# Altium schematic sheet racer.SchDoc: Wacky Racers Racer
size A3; DrawnBy: Mark Arunchayanon, Abhi Chhabara, Luke Trenberth, Sasiru Goonatilake; Address1: ECE Department; Address2: University of Canterbury; Address3: Christchurch 8041; Address4: New Zealand; Revision: 1
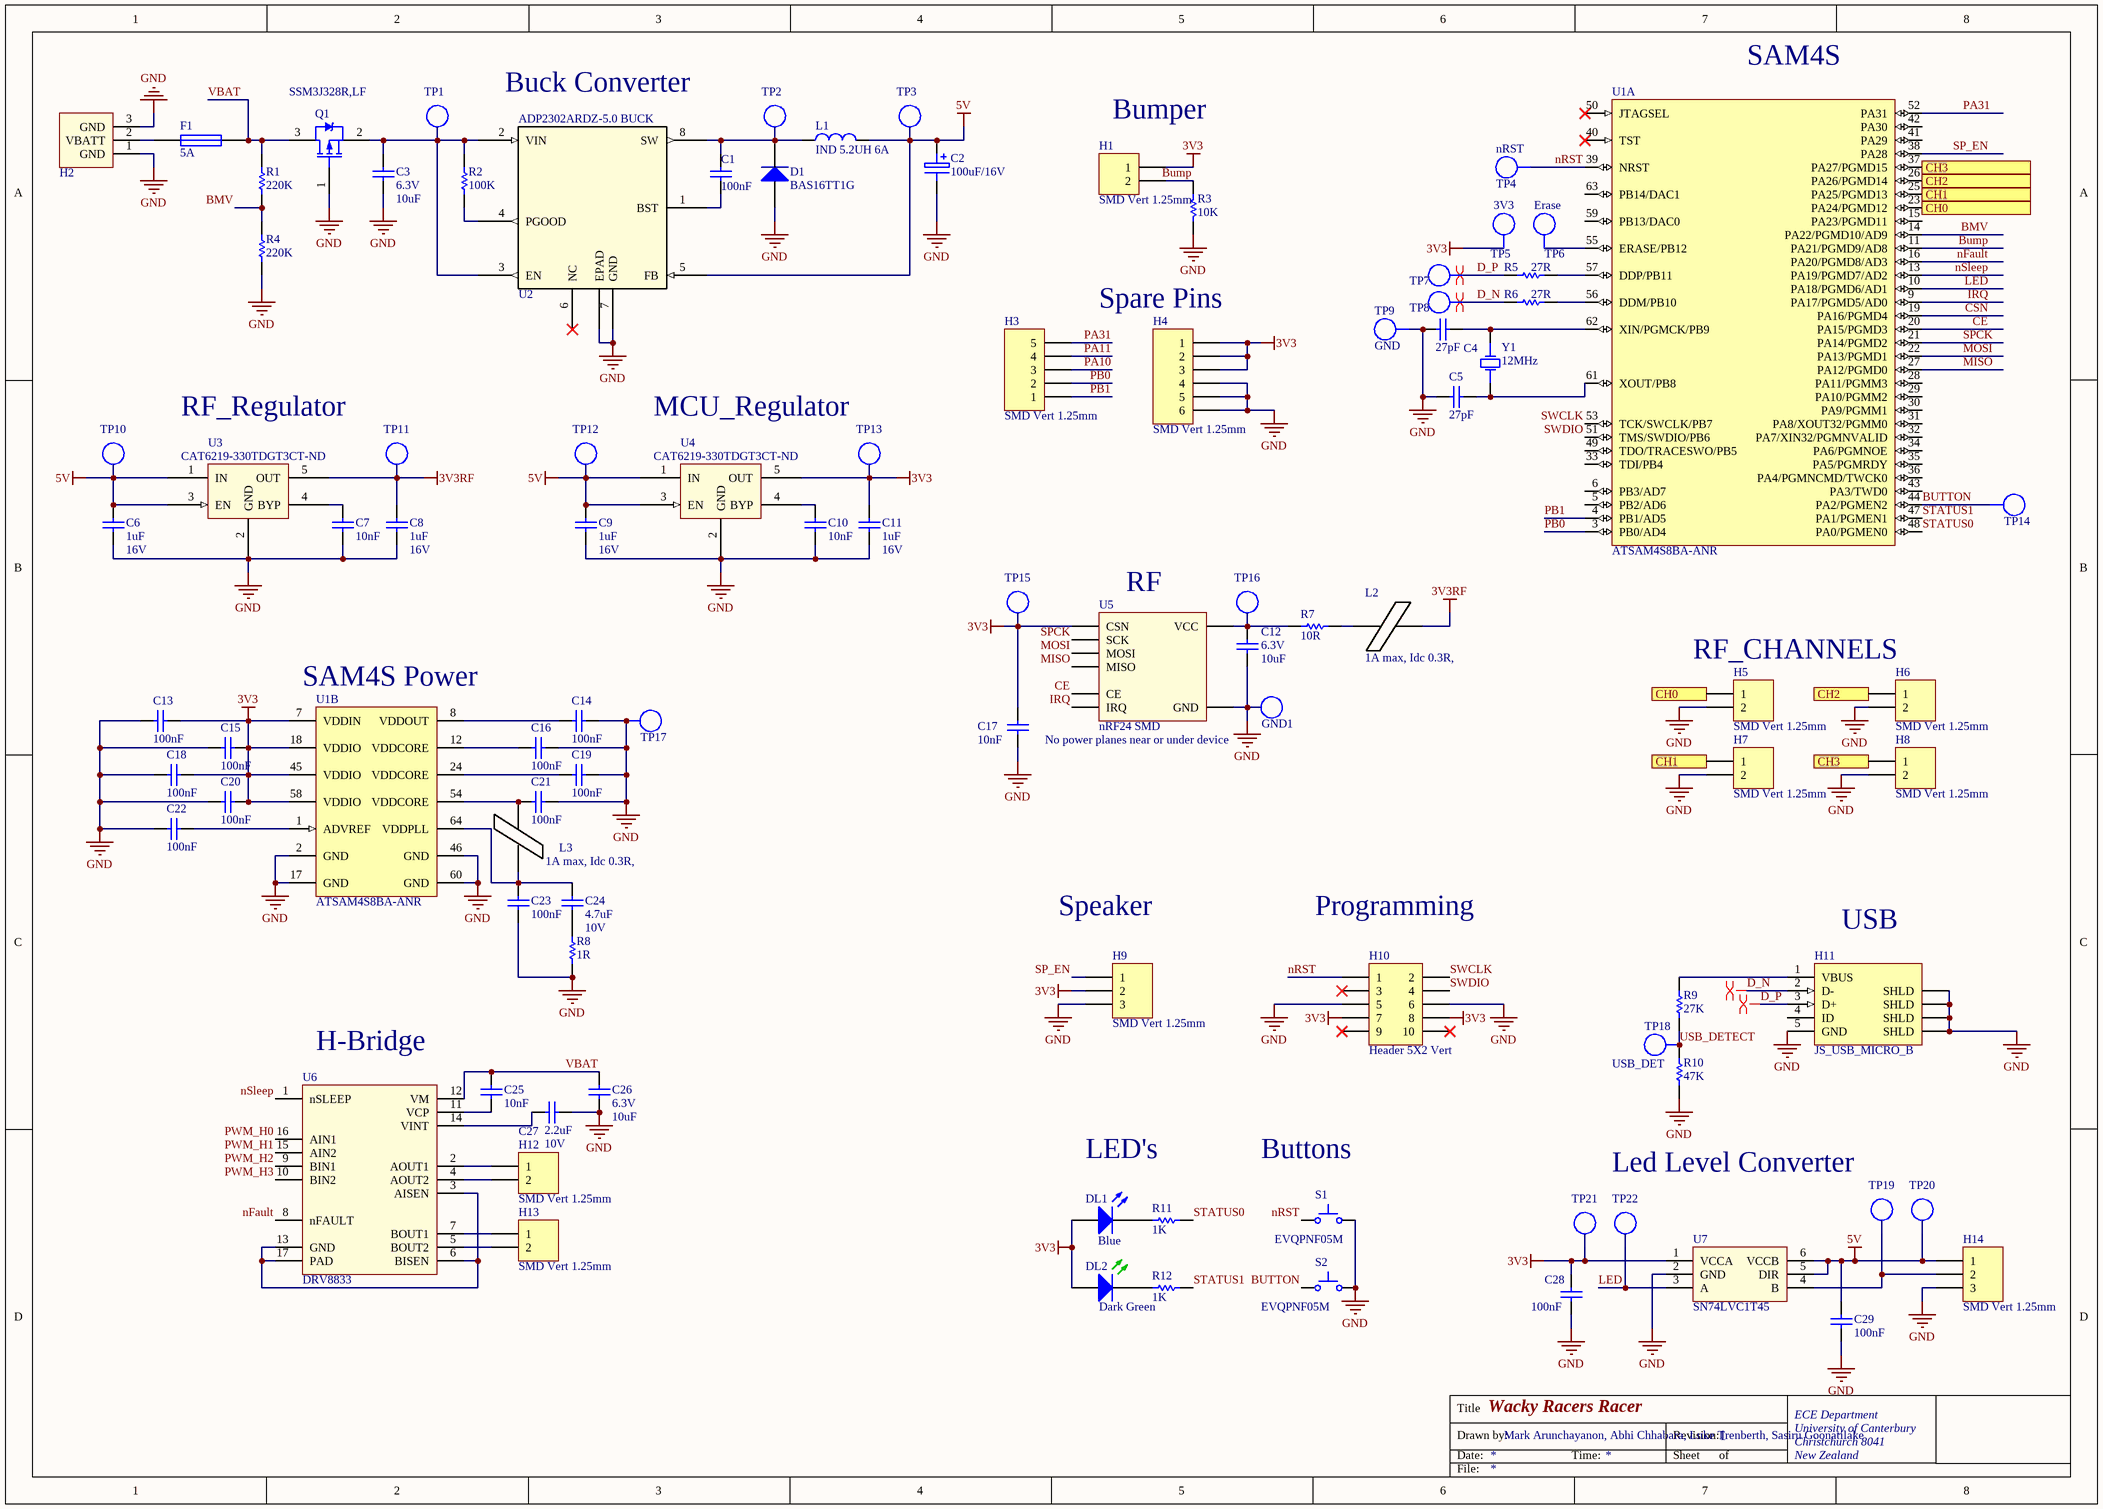
[diagram p0: racer.SchDoc]

## Parts
C1  100nF  [CAPC1608L]
C2  100uF/16V  [NICH-1]
C3  Voltage - Rated: 6.3V  [CAPC1608L]  (hidden comment: 10uF)
C4  27pF  [CAPC1608L]
C5  27pF  [CAPC1608L]
C6  Max Voltage: 16V  [CAPC1608L]  (hidden comment: 1uF)
C7  10nF  [CAPC1608L]
C8  Max Voltage: 16V  [CAPC1608L]  (hidden comment: 1uF)
C9  Max Voltage: 16V  [CAPC1608L]  (hidden comment: 1uF)
C10  10nF  [CAPC1608L]
C11  Max Voltage: 16V  [CAPC1608L]  (hidden comment: 1uF)
C12  Voltage - Rated: 6.3V  [CAPC1608L]  (hidden comment: 10uF)
C13  100nF  [CAPC1608L]
C14  100nF  [CAPC1608L]
C15  100nF  [CAPC1608L]
C16  100nF  [CAPC1608L]
C17  10nF  [CAPC1608L]
C18  100nF  [CAPC1608L]
C19  100nF  [CAPC1608L]
C20  100nF  [CAPC1608L]
C21  100nF  [CAPC1608L]
C22  100nF  [CAPC1608L]
C23  100nF  [CAPC1608L]
C24  Max Voltage: 10V  [CAPC1608N]  (hidden comment: 4.7uF)
C25  10nF  [CAPC1608L]
C26  Voltage - Rated: 6.3V  [CAPC1608L]  (hidden comment: 10uF)
C27  Max Voltage: 10V  [CAPC1608L]  (hidden comment: 2.2uF)
C28  100nF  [CAPC1608L]
C29  100nF  [CAPC1608L]
D1  BAS16TT1G  [SOT416]
DL1  Blue  [WL-SMCW0603]
DL2  Dark Green  [WL-SMCW0603]
F1  5A  [RESC3216N]
GND1  TP_0603  [TP_0603]  (value not drawn)
H1  SMD Vert 1.25mm  [SD-53398-0219]
H2  Battery_HEADER_3pin  [BATT_HEADER_3POS]  (value not drawn)
H3  SMD Vert 1.25mm  [SD-53398-0519]
H4  SMD Vert 1.25mm  [SD-53398-0619]
H5  SMD Vert 1.25mm  [SD-53398-0219]
H6  SMD Vert 1.25mm  [SD-53398-0219]
H7  SMD Vert 1.25mm  [SD-53398-0219]
H8  SMD Vert 1.25mm  [SD-53398-0219]
H9  SMD Vert 1.25mm  [SD-53398-0319]
H10  Header 5X2 Vert  [IDC2.54-V10D]
H11  JS_USB_MICRO_B  [FCI_USB_10118194-0001LF]
H12  SMD Vert 1.25mm  [SD-53398-0219]
H13  SMD Vert 1.25mm  [SD-53398-0219]
H14  SMD Vert 1.25mm  [SD-53398-0319]
L1  IND 5.2UH 6A  [INDUCTOR5u2]
L2  1A max, Idc 0.3R,  [INDC3216L]
L3  1A max, Idc 0.3R,  [INDC3216L]
Q1  SSM3J328R,LF  [SOT23_L]
R1  220K  [RESC1608L]
R2  100K  [RESC1608L]
R3  10K  [RESC1608L]
R4  220K  [RESC1608L]
R5  27R  [RESC3216L]
R6  27R  [RESC3216L]
R7  10R  [RESC1608L]
R8  1R  [RESC3216L]
R9  27K  [RESC1608L]
R10  47K  [RESC1608N]
R11  1K  [RESC1608L]
R12  1K  [RESC1608L]
S1  EVQPNF05M  [EVQPNF05M]
S2  EVQPNF05M  [EVQPNF05M]
TP1  TP_0603  [TP_0603]  (value not drawn)
TP2  TP_0603  [TP_0603]  (value not drawn)
TP3  TP_0603  [TP_0603]  (value not drawn)
TP4  nRST  [TP_1206]  (no BOM)
TP5  3V3  [TP_1206]  (no BOM)
TP6  Erase  [TP_1206]  (no BOM)
TP7  TP  [TP_1206]  (value not drawn)  (no BOM)
TP8  TP  [TP_1206]  (value not drawn)  (no BOM)
TP9  GND  [TP_1206]  (no BOM)
TP10  TP_0603  [TP_0603]  (value not drawn)
TP11  TP_0603  [TP_0603]  (value not drawn)
TP12  TP_0603  [TP_0603]  (value not drawn)
TP13  TP_0603  [TP_0603]  (value not drawn)
TP14  TP  [TP_1206]  (value not drawn)  (no BOM)
TP15  TP_0603  [TP_0603]  (value not drawn)
TP16  TP_0603  [TP_0603]  (value not drawn)
TP17  TP  [TP_1206]  (value not drawn)  (no BOM)
TP18  USB_DET  [TP_1206]  (no BOM)
TP19  TP_0603  [TP_0603]  (value not drawn)
TP20  TP_0603  [TP_0603]  (value not drawn)
TP21  TP_0603  [TP_0603]  (value not drawn)
TP22  TP_0603  [TP_0603]  (value not drawn)
U1  ATSAM4S8BA-ANR  [LQFP64_L]  (parts A,B of 2)
U2  ADP2302ARDZ-5.0 BUCK  [RD_8_1]
U3  Supplier Part Number: CAT6219-330TDGT3CT-ND  [SOT95P280X145-5N]  (hidden comment: CAT6219-330TDGT3)
U4  Supplier Part Number: CAT6219-330TDGT3CT-ND  [SOT95P280X145-5N]  (hidden comment: CAT6219-330TDGT3)
U5  nRF24 SMD  Warning: No power planes near or under device  [NRF24]
U6  DRV8833  [HTSOP16]
U7  SN74LVC1T45  [SOT23-6_N]
Y1  12MHz  [HC49/4h_SMX]

## Ports
CH0 (in), CH0 (out), CH1 (in), CH1 (out), CH2 (in), CH2 (out), CH3 (in), CH3 (out)

## Nets
3V3: C11.2 C13.2 C15.2 C17.2 C18.2 C20.2 C28.1 DL1.2(A) DL2.2(A) H1.1 H4.1 H4.2 H4.3 H9.2 H10.7 H10.8 TP5.1 TP13.1(TP) TP15.1(TP) TP21.1(TP) U1.7(VDDIN) U1.18(VDDIO) U1.45(VDDIO) U1.58(VDDIO) U4.5(OUT) U5.4(CSN) U7.1(VCCA)
3V3RF: C8.2 L2.2 TP11.1(TP) U3.5(OUT)
5V: C2.2 C6.2 C9.2 C29.1 H14.1 L1.2 TP3.1(TP) TP10.1(TP) TP12.1(TP) TP20.1(TP) U2.5(FB) U3.1(IN) U3.3(EN) U4.1(IN) U4.3(EN) U7.5(DIR) U7.6(VCCB)
GND: C2.1 C3.1 C4.2 C5.2 C6.1 C7.1 C8.1 C9.1 C10.1 C11.1 C12.1 C13.1 C14.2 C15.1 C16.2 C17.1 C18.1 C19.2 C20.1 C21.2 C22.1 C23.1 C26.1 C27.2 C28.2 C29.2 D1.1(A) GND1.1(TP) H2.1(GND) H2.3(GND) H4.4 H4.5 H4.6 H5.2 H6.2 H7.2 H8.2 H9.3 H10.5 H10.6 H11.5(GND) H11.6(SHLD) H14.3 Q1.1 R3.1 R4.1 R8.1 R10.1 S1.2 S2.2 TP9.1 TP17.1 U1.2(GND) U1.17(GND) U1.46(GND) U1.60(GND) U2.7(GND) U2.EPAD U3.2(GND) U4.2(GND) U5.2(GND) U7.2(GND)
BMV: R1.1 R4.2 U1.14(PA22/PGMD10/AD9)
Bump: H1.2 R3.2 U1.11(PA21/PGMD9/AD8)
BUTTON: S2.1 TP14.1 U1.44(PA2/PGMEN2)
CE: U1.20(PA15/PGMD3) U5.3(CE)
CH0: H5.1 U1.23(PA24/PGMD12) ; port CH0
CH1: H7.1 U1.25(PA25/PGMD13) ; port CH1
CH2: H6.1 U1.26(PA26/PGMD14) ; port CH2
CH3: H8.1 U1.37(PA27/PGMD15) ; port CH3
CSN: U1.19(PA16/PGMD4)
D_N: H11.2(D-) R6.1 TP8.1
D_P: H11.3(D+) R5.1 TP7.1
IRQ: U1.9(PA17/PGMD5/AD0) U5.8(IRQ)
LED: TP22.1(TP) U1.10(PA18/PGMD6/AD1) U7.3(A)
MISO: U1.27(PA12/PGMD0) U5.7(MISO)
MOSI: U1.22(PA13/PGMD1) U5.6(MOSI)
nFault: U1.16(PA20/PGMD8/AD3) U6.8(nFAULT)
nRST: H10.1 S1.1 TP4.1 U1.39(NRST)
nSleep: U1.13(PA19/PGMD7/AD2) U6.1(nSLEEP)
PA10: H3.3
PA11: H3.4
PA31: H3.5 U1.52(PA31)
PB0: H3.2 U1.3(PB0/AD4)
PB1: H3.1 U1.4(PB1/AD5)
PWM_H0: U6.16(AIN1)
PWM_H1: U6.15(AIN2)
PWM_H2: U6.9(BIN1)
PWM_H3: U6.10(BIN2)
SP_EN: H9.1 U1.38(PA28)
SPCK: U1.21(PA14/PGMD2) U5.5(SCK)
STATUS0: R11.2 U1.48(PA0/PGMEN0)
STATUS1: R12.2 U1.47(PA1/PGMEN1)
SWCLK: H10.2 U1.53(TCK/SWCLK/PB7)
SWDIO: H10.4 U1.51(TMS/SWDIO/PB6)
USB_DETECT: R9.1 R10.2 TP18.1
VBAT: C25.1 C26.2 F1.2 Q1.3 R1.2 U6.12(VM)
NetC1_1: C1.1 D1.3(K) L1.1 TP2.1(TP) U2.8(SW)
NetC1_2: C1.2 U2.1(BST)
NetC3_2: C3.2 Q1.2 R2.2 TP1.1(TP) U2.2(VIN) U2.3(EN)
NetC4_1: C4.1 U1.62(XIN/PGMCK/PB9) Y1.2(OSC2)
NetC5_1: C5.1 U1.61(XOUT/PB8) Y1.1(OSC1)
NetC7_2: C7.2 U3.4(BYP)
NetC10_2: C10.2 U4.4(BYP)
NetC12_2: C12.2 R7.1 TP16.1(TP) U5.1(VCC)
NetC14_1: C14.1 U1.8(VDDOUT)
NetC16_1: C16.1 U1.12(VDDCORE)
NetC19_1: C19.1 U1.24(VDDCORE)
NetC21_1: C21.1 L3.2 U1.54(VDDCORE)
NetC22_2: C22.2 U1.1(ADVREF)
NetC23_2: C23.2 C24.2 L3.1 U1.64(VDDPLL)
NetC24_1: C24.1 R8.2
NetC25_2: C25.2 U6.11(VCP)
NetC27_1: C27.1 U6.14(VINT)
NetDL1_1: DL1.1(K) R11.1
NetDL2_1: DL2.1(K) R12.1
NetF1_1: F1.1 H2.2(VBATT)
NetH11_1: H11.1(VBUS) R9.2
NetH12_1: H12.1 U6.2(AOUT1)
NetH12_2: H12.2 U6.4(AOUT2)
NetH13_1: H13.1 U6.7(BOUT1)
NetH13_2: H13.2 U6.5(BOUT2)
NetH14_2: H14.2 TP19.1(TP) U7.4(B)
NetL2_1: L2.1 R7.2
NetR2_1: R2.1 U2.4(PGOOD)
NetR5_2: R5.2 U1.57(DDP/PB11)
NetR6_2: R6.2 U1.56(DDM/PB10)
NetTP6_1: TP6.1 U1.55(ERASE/PB12)
NetU6_3: U6.3(AISEN) U6.6(BISEN) U6.13(GND) U6.17(PAD)

Not connected (* = marked no-connect by the designer): H10 3* 9* 10*; H11 4(ID); U1 5(PB2/AD6) 6(PB3/AD7) 15(PA23/PGMD11) 28(PA11/PGMM3) 29(PA10/PGMM2) 30(PA9/PGMM1) 31(PA8/XOUT32/PGMM0) 32(PA7/XIN32/PGMNVALID) 33(TDI/PB4) 34(PA6/PGMNOE) 35(PA5/PGMRDY) 36(PA4/PGMNCMD/TWCK0) 40(TST)* 41(PA29) 42(PA30) 43(PA3/TWD0) 49(TDO/TRACESWO/PB5) 50(JTAGSEL)* 59(PB13/DAC0) 63(PB14/DAC1); U2 6(NC)*

## Layout directives
differential pair: D_N, D_P

## Notes on the sheet
- (near U2) Buck Converter
- (near U1) SAM4S
- (near H1) Bumper
- (near H4) Spare Pins
- RF_Regulator
- MCU_Regulator
- (near U5) RF
- (near U1) SAM4S Power
- (near H5) RF_CHANNELS
- Speaker
- Programming
- (near H11) USB
- H-Bridge
- LED's
- Buttons
- Led Level Converter
- Title
- Drawn by:
- Date:
- Time:
- Revision:
- Sheet
- of
- File:

## Library data of the parts
C1 C13-C16 C18-C23 C28 C29 = CC_100nF_0603: CAP CER 100nF X7R +-10% 50V 0603; PackageReference: 0603; Code_IPC: 1608 [0603]; Verify: *; Supplier: ECE Dept; Storage Location: PCB Assembly WS; Value: 100nF
C2 = CA_100uF_16V: CAP ALUM 100uF 16V SMD; Manufacturer PN: UWX1C101MCL1GB; Manufacturer: Nichcon; Supplier 1: Farnell; Supplier Part Number 1: 1870677; Storage Location: PCB Assembly WS; Supplier: ECE Dept; Supplier 2: Digi-Key; Supplier Part Number 2: 493-2105-1-ND; Value: 100uF/16V
C3 C12 C26 = CC_10uF_0603: CAP CER 10UF X5R +-20% 6V3 0603; Supplier: ECE Dept; Storage Location: PCB Assembly WS; Value: 10uF
C4 C5 = CC_27pF_0603: CAP CER 27pF NPO/COG +-5% 50V 0603; PackageReference: 0603; Code_IPC: 1608 [0603]; Verify: *; Supplier: ECE Dept; Storage Location: PCB Assembly WS; Value: 27pF
C6 C8 C9 C11 = CC_1uF_0603: CAP CER 1uF Y5V -20% +80% 16V 0603; PackageReference: 0603; Code_IPC: 1608 [0603]; Verify: *; Supplier: ECE Dept; Storage Location: PCB Assembly WS; Value: 1uF
C7 C10 C17 C25 = CC_10nF_0603: CAP CER 10nF X7R +-10% 50V 0603; PackageReference: 0603; Code_IPC: 1608 [0603]; Verify: *; Supplier: ECE Dept; Storage Location: PCB Assembly WS; Value: 10nF
C24 = CC_4.7uF_0603: CAP CER 4.7uF X5R +-20%  10V 0603; Note: Footprint corresponds to dimensions for bulk cassette packaging. This case size has tightened tolerances.; PackageReference: 0805; Code_IPC: 2012[0805]; Verify: *; Supplier: ECE Dept; Storage Location: PCB Assembly WS; Value: 4.7uF
C27 = CC_2.2uF_0603: CAP CER 2.2uF X5R +-20% 10V 0603; PackageReference: 0603; Code_IPC: 1608 [0603]; Verify: *; Supplier: ECE Dept; Storage Location: PCB Assembly WS; Value: 2.2uF
D1 = DR_BAS16TT1G: Diode Switching, Vr 75V, 200mA, SOT-416; Manufacturer: ON Semiconductor; Max Surge Current: 500mA; Forward Voltage: 1.25V; Peak Reverse Current: 1uA; Recovery Time: 6ns; Power Dissipation: 225mW; Element Configuration: Single; Polarity: Standard; Max Reverse Voltage (DC): 100V; Manufacturer PN: BAS16TT1G; Storage Location: PCB Assembly WS; Supplier: ECE Dept; Manufacturer Part Number: BAS16TT1G; Case/Package: SOT-416-3; Number of Pins: 3; Contact Plating: Tin,Matte; Min Operating Temperature: -55°C; Max Operating Temperature: 150°C; Package Quantity: 1; Packaging: Tape and Reel; Forward Current: 200mA; Average Rectified Current: 200mA; Reverse Recovery Time: 6ns; Peak Non-Repetitive Surge Current: 500mA; Max Repetitive Reverse Voltage (Vrrm): 75V; Max Forward Surge Current (Ifsm): 500mA; Current Rating: 200mA; Output Current: 200mA; Length: 1.65mm; Height: 0.9mm; Width: 0.9mm; Radiation Hardening: No; REACH SVHC: No SVHC; Lead Free: Lead Free; Halogen Free: Halogen Free; ComponentLink1URL: https://datasheet.ciiva.com/8299/bas16tt1-d-8299729.pdf; ComponentLink1Description: https://datasheet.ciiva.com/8299/bas16tt1-d-8299729.pdf; ComponentLink2URL: https://datasheet.ciiva.com/4435/bas16tt1-d-103455-4435027.pdf; ComponentLink2Description: https://datasheet.ciiva.com/4435/bas16tt1-d-103455-4435027.pdf; ComponentLink3URL: https://datasheet.ciiva.com/28646/bas16tt1-d-28646580.pdf; ComponentLink3Description: https://datasheet.ciiva.com/28646/bas16tt1-d-28646580.pdf; ComponentLink4URL: https://datasheet.ciiva.com/16393/bas16tt1-d-16393622.pdf; ComponentLink4Description: https://datasheet.ciiva.com/16393/bas16tt1-d-16393622.pdf; ComponentLink5URL: https://datasheet.ciiva.com/923/bas16tt1-d-923016.pdf; ComponentLink5Description: https://datasheet.ciiva.com/923/bas16tt1-d-923016.pdf; ComponentLink6URL: https://datasheet.ciiva.com/923/bas16tt1-d-923017.pdf; ComponentLink6Description: https://datasheet.ciiva.com/923/bas16tt1-d-923017.pdf; ComponentLink7URL: https://datasheet.ciiva.com/923/bas16tt1-d-923018.pdf; ComponentLink7Description: https://datasheet.ciiva.com/923/bas16tt1-d-923018.pdf; ComponentLink8URL: https://datasheet.ciiva.com/25930/bas16tt1-d-25930986.pdf; ComponentLink8Description: https://datasheet.ciiva.com/25930/bas16tt1-d-25930986.pdf; Supplier 1: Digi-Key; Supplier 2: Farnell; Supplier Part Number 2: 2844752; Supplier Part Number 1: BAS16TT1GOSDKR-ND; Value: BAS16TT1G
DL1 = DL_150060BS75000: LED Blue 270mcd 0603 SMD; Manufacturer: WURTH ELEKTRONIK; Forward Current If: 30; Forward Voltage: 3.2; Luminous Intensity: 270; Viewing Angle: 120°; Wavelength Typ: 470; Pricing: 1=0.3844, 50=0.3252, 100=0.2957, 500=0.2365 (NZD); Supplier 1: Farnell; Supplier Part Number 1: 2322069; Manufacturer Part Number: 150060BS75000; Storage Location: PCB Assembly WS; Supplier: ECE Dept; LED Colour: Blue
DL2 = DL_150060GS75000: LED Dk Green 430mcd 0603 SMD; Manufacturer: WURTH ELEKTRONIK; Forward Current If: 30; Wavelength Typ: 520; Forward Voltage: 3.2; Lens Shape: Rectangular; Luminous Intensity: 430; Viewing Angle: 140°; LED Mounting: SMD; Supplier 1: Farnell; Supplier Part Number 1: 2322070; Manufacturer Part Number: 150060GS75000; Storage Location: PCB Assembly WS; Supplier: ECE Dept; LED Colour: Dark Green
F1 = FS_Fuse_5.0A: Fuse 5.0A Fast Acting 1206 SMD; Manufacturer Part Number: C1F5; Manufacturer: Bel TRP; Voltage Rating (AC): 125V; Voltage Rating (DC): 63V; DC Cold Resistance: 19mR; Fuse Type: Board Mount (Cartridge Style Excluded); Approvals: CE,cURus; Mount: Surface Mount; Case/Package: 1206; Number of Pins: 2; Case Code (Metric): 3216; Case Code (Imperial): 1206; Contact Plating: Nickel,Tin; Min Operating Temperature: -55°C; Max Operating Temperature: 125°C; Packaging: Tape and Reel; Voltage Rating: 125V; Length: 0.126inch; Width: 0.062inch; Supplier 1: Digi-Key; Stock 1: 725; Pricing 1: 1=0.32, 5=0.312, 10=0.298, 50=0.2662, 100=0.2479, 250=0.22032, 500=0.1836, 1000=0.17442 (USD); ComponentLink1URL: http://www.farnell.com/datasheets/2571625.pdf; ComponentLink1Description: http://www.farnell.com/datasheets/2571625.pdf; ComponentLink2URL: http://belfuse.com/pdfs/C1F.pdf; ComponentLink2Description: http://belfuse.com/pdfs/C1F.pdf; ComponentLink3URL: http://www.mouser.com/ds/2/643/C1F-594910.pdf; ComponentLink3Description: http://www.mouser.com/ds/2/643/C1F-594910.pdf; ComponentLink4URL: https://belfuse.com/resources/StewartConnector/C1F.pdf; ComponentLink4Description: https://belfuse.com/resources/StewartConnector/C1F.pdf; Current Rating: 5A; Supplier Part Number 1: 507-1886-1-ND; Supplier 2: Element14; Supplier Part Number 2: 2848595; Value: 5A
GND1 TP1-TP3 TP10-TP13 TP15 TP16 TP19-TP22 = TP_0603: Test Point 1.65X0.9X1.2mm SMD; Manufacturer: TE Connectivity AMP Connectors; Manufacturer Part Number: 1625854-3; Supplier 1: Digi-Key; Mounting Type: Surface Mount; Terminal: 0.063" x 0.031" x 0.045" (1.60mm x 0.80mm x 1.15mm); Type: PC Test Point; Supplier Part Number 1: A106145CT-ND
H1 H5-H8 H12 H13 = JB_53398-02: Header_Vert_2Pos_1.25mm_125V@1A_SMT; Manufacturer: Molex Inc; Manufacturer Part Number: 0533980271; Number of Positions: 2; Pitch: 0.049" (1.25mm); Contact Type: Blade Pin; Mounting Type: Surface Mount; Supplier 1: Digi-Key; Supplier Part Number 1: WM7606CT-ND; Supplier: ECE Dept; Storage Location: PCB Assembly WS; Value: SMD Vert 1.25mm
H2 = Battery_HEADER_3pin: 3Pin Header 2.54mm spacing
H3 = JB_53398-05: Header_Vert_5Pos_1.25mm_125V@1A_SMT; Manufacturer: MOLEX; Manufacturer Part Number: 53398-0571; Contact Termination: Surface Mount Vertical; Current Rating: 1; Series: PicoBlade; Supplier 1: Farnell; Supplier Part Number 1: 1125354; Supplier: ECE Dept; Storage Location: PCB Assembly WS; Value: SMD Vert 1.25mm
H4 = JB_53398-06: Header_Vert_6Pos_1.25mm_125V@1A_SMT; Manufacturer: Molex Inc; Manufacturer Part Number: 0533980671; Number of Positions: 6; Contact Type: Blade Pin; Supplier 1: Digi-Key; Supplier Part Number 1: WM7610CT-ND; Supplier: ECE Dept; Storage Location: PCB Assembly WS; Value: SMD Vert 1.25mm
H9 H14 = JB_53398-03: Header_Vert_3Pos_1.25mm_125V@1A_SMT; Manufacturer: MOLEX; Manufacturer Part Number: 53398-0371; Contact Termination: Surface Mount Vertical; Current Rating: 1; External Depth: 3.7; External Length / Height: 4.7; Gender: Header; No. of Contacts: 3; Series: PicoBlade; Supplier 1: Farnell; Supplier Part Number 1: 1125353; Supplier: ECE Dept; Storage Location: PCB Assembly WS; Value: SMD Vert 1.25mm
H10 = JA_HDR_IDC_5X2_VERT: IDC Header, 2,54mm, 10-Pin, Vert; Supplier: ECE Dept; Supplier 1: Farnell; Supplier Part Number 1: 1096985; Storage Location: ECE Dept Store
H11 = JS_USB_MICRO_B_SMT: CONN USB MICRO B RECPT SMT R/A; Manufacturer: FCI; Manufacturer Part Number: 10118194-0001LF; Gender: Receptacle; Number of Contacts: 5; Specifications: USB 2.0; Supplier 1: Digi-Key; Supplier Part Number 1: 609-4618-1-ND; Features: Shielded, Solder Retention; Mounting Type: Surface Mount, Right Angle, Horizontal
L1 = CDRH104RNP-5R2NC: FIXED IND 5.2UH 6A 22 MOHM SMD; Manufacturer: Sumida America Components Inc.; Material - Core: Ferrite; Tolerance: ±30%; Current - Saturation: 5.6A; Shielding: Shielded; DC Resistance (DCR): 22 mOhm Max; Supplier 1: Digi-Key; Manufacturer Part Number: CDRH104RNP-5R2NC; RoHS: RoHS Compliant; Category: Inductors, Coils, Chokes; Stock 1: 3849; Pricing 1: 1=2.9, 10=2.678, 100=1.8743, 500=1.5173 (NZD); Packaging: Cut Tape (CT); Part Status: Active; Type: -; Q @ Freq: -; Frequency - Self Resonant: -; Ratings: -; Operating Temperature: -40°C ~ 100°C; Mounting Type: Surface Mount; Package / Case: Nonstandard; Supplier Device Package: -; Size / Dimension: 0.402" L x 0.394" W (10.20mm x 10.00mm); Height - Seated (Max): 0.157" (4.00mm); ComponentLink1URL: http://products.sumida.com/products/pdf/CDRH104R.pdf; ComponentLink1Description: http://products.sumida.com/products/pdf/CDRH104R.pdf; Supplier Part Number 1: 308-2280-1-ND
L2 L3 = IN_Ferrite-Bead: Ferrite Bead, Rdc 0.3R, Z100MHZ 600R, Imax 1A, SMD 1206; Manufacturer: FAIR-RITE; Manufacturer PN: 2512066017Y1; DC Current Rating: 1; DC Resistance Max: 0.08; Ferrite Case Style: 1206 ^3216 Metric]; Frequency Range: 50MHz to 1; Impedance: 600; Impedance Tolerance: ± 25%; Supplier: ECE Dept; Storage Location: PCB Assembly WS; Ferrite Mounting: SMD; Supplier 1: Farnell; Supplier Part Number 1: 1612060; Manufacturer Part Number: 2512066017Y1; Value: 1A max, Idc 0.3R,
Q1 = TM_SSM3J328R: MOSFET P-CH 20V 6A SOT23-3; Manufacturer: Toshiba; FET Feature: Logic Level Gate, 1.5V Drive; FET Type: MOSFET P-Channel, Metal Oxide; Gate Charge (Qg) @ Vgs: 12.8nC @ 4.5V; Input Capacitance (Ciss) @ Vds: 840pF @ 10V; Power - Max: 1W; Rds On Max: 29.8mR; Drain to Source Resistance: 47.4mR; Turn-On Delay Time: 32ns; Power Dissipation: 2W; Number of Channels: 1; Turn-Off Delay Time: 107ns; Gate to Source Voltage (Vgs): 8V; Input Capacitance: 840pF; Element Configuration: Single; Drain to Source Breakdown Voltage: -20V; Vgs(th) (Max) @ Id: 1V @ 1mA; Current - Continuous Drain (Id) @ 25° C: 6A; Drain to Source Voltage (Vdss): 20V; Package / Case: SOT-23-3 Flat Leads; Supplier Device Package: SOT-23F; Pricing: 1=0.79, 10=0.658, 25=0.5772, 100=0.4939, 250=0.42836, 500=0.36284, 1000=0.27972 (NZD); Storage Location: PCB Assembly WS; Supplier: Digi-Key; ComponentLink1URL: https://datasheet.ciiva.com/11158/ssm3j328r-datasheet-en-20140301-11158652.pdf; ComponentLink1Description: https://datasheet.ciiva.com/11158/ssm3j328r-datasheet-en-20140301-11158652.pdf; Supplier Part Number: SSM3J328RLFDKR-ND; Max Operating Temperature: 150°C; Mount: Surface Mount; Packaging: Tape and Reel; Min Operating Temperature: -55°C; Continuous Drain Current (ID): 6A; Radiation Hardening: No; Max Power Dissipation: 1W; Package Quantity: 3000; Case/Package: SOT-23-3; Number of Pins: 3; Number of Elements: 1; Supplier 1: Digi-Key; Supplier Part Number 1: SSM3J328RLFDKR-ND; Manufacturer Part Number: SSM3J328R,LF
R1 R4 = RS_220K: RES 3.3K OHM 1/10W 5% 0603 SMD; Storage Location: PCB Assembly WS; Supplier: ECE Dept; Value: 220K
R2 = RS_100K: RES 100K OHM 1/10W 5% 0603 SMD; Storage Location: PCB Assembly WS; Supplier: ECE Dept; Value: 100K
R3 = RS_10K: RES 10.0K OHM 1/10W 5% 0603 SMD; Storage Location: PCB Assembly WS; Supplier: ECE Dept; Value: 10K
R5 R6 = RT_27R: RES 27R OHM 1/4W 5% 1206 SMD; Storage Location: PCB Assembly WS; Supplier: ECE Dept; Value: 27R
R7 = RS_10R: RES 10 OHM 1/10W 5% 0603 SMD; Storage Location: PCB Assembly WS; Supplier: ECE Dept; Value: 10R
R8 = RT_1R: RES 1R OHM 1/4W 5% 1206 SMD; Storage Location: PCB Assembly WS; Supplier: ECE Dept; Value: 1R
R9 = RS_27K: RES 27K OHM 1/10W 5% 0603 SMD; Storage Location: PCB Assembly WS; Supplier: ECE Dept; Value: 27K
R10 = RS_47K: RES 47.0K OHM 1/10W 5% 0603 SMD; Storage Location: PCB Assembly WS; Supplier: ECE Dept; Value: 47K
R11 R12 = RS_1K: RES 1.0K OHM 1/10W 5% 0603 SMD; Storage Location: PCB Assembly WS; Supplier: ECE Dept; Value: 1K
S1 S2 = WS_EVQPNF05M: Panasonic 6 x 3.5mm SMD Light Touch Switch Type SMD; PackageDescription: 6.0 x 3.5 mm; Supplier 1: Farnell; Supplier Part Number 1: 2079481; Manufacturer: Panasonic; Manufacturer PN: EVQPNF05M; Supplier 2: Digi-Key; Supplier Part Number 2: P13598SCT-ND; Storage Location: PCB Assembly WS; Supplier: ECE Dept
TP4-TP6 TP9 TP18 = TP_1206: Test-Point 3.3x1.6x2.1mm SMD; Manufacturer: Harwin Inc; Manufacturer Part Number: S1751-46R; Value: TP; Manufacturer PN: *; Storage Location: ProtoPlace; Mounting Type: Surface Mount; Type: PC Test Point; Supplier 1: Digi-Key; Supplier Part Number 1: 952-1478-2-ND; Supplier 2: Farnell; Supplier Part Number 2: 1826282; Supplier: ECE Dept
TP7 TP8 TP14 TP17 = TP_1206: Test-Point 3.3x1.6x2.1mm SMD; Manufacturer: Harwin Inc; Manufacturer Part Number: S1751-46R; Manufacturer PN: *; Storage Location: ProtoPlace; Mounting Type: Surface Mount; Type: PC Test Point; Supplier 1: Digi-Key; Supplier Part Number 1: 952-1478-2-ND; Supplier 2: Farnell; Supplier Part Number 2: 1826282; Supplier: ECE Dept; Value: TP
U1 = SE_ATSAM4S16BA-MU: IC MCU 32BIT 512KB FLASH 64LQFP; Manufacturer: Atmel; Connectivity: I²C, IrDA, Memory Card, SPI, SSC, UART/USART, USB; Core Processor: ARM® Cortex®-M4; Core Size: 32-Bit; Data Converters: A/D 11x12b, D/A 2x12b; Number of I/O: 47; Peripherals: Brown-out Detect/Reset, DMA, POR, PWM, WDT; Program Memory Size: 512KB (512K x 8); RAM Size: 128K x 8; Speed: 120MHz; Voltage - Supply (Vcc/Vdd): 1.62 V ~ 3.6 V; PackageVersion: revJ, Jul-2007; PackageReference: 64PS; PackageDescription: 64-Pin Quad Flat No-Lead (QFN) Sawn, 9 x 9 x 1.0 mm Body, 0.5 mm Pitch, Exposed Pad; Code_JEDEC: MO-220VMMD-3; ComponentLink1Description: Manufacturer URL; ComponentLink1URL: http://www.atmel.com/; ComponentLink2Description: SAM4S Series Datasheet; ComponentLink2URL: http://www.atmel.com/dyn/resources/prod_documents/11100.pdf; ComponentLink3Description: SAM4S Series Summary; ComponentLink3URL: http://www.atmel.com/dyn/resources/prod_documents/11100S.pdf; Supplier 1: Digi-Key; Package / Case: 64-LQFP; Packaging: Cut Tape (CT); Program Memory Type: FLASH; Supplier Part Number 1: ATSAM4S8BA-ANRCT-ND; Manufacturer Part Number: ATSAM4S8BA-ANR
U2 = ADP2302ARDZ-5.0-R7: IC REG BUCK 5V 2A 8SOIC; Vendor: Analog Devices Inc; Frequency - Switching: 700kHz; Output Type: Fixed; Voltage - Input (Max): 20V; Manufacturer_Part_Number: ADP2302ARDZ-5.0-R7; Type: DEV; Value: Value; Supplier 1: Digi-Key; Current - Output: 2A; Voltage - Output (Min/Fixed): 5V; Supplier Part Number 1: ADP2302ARDZ-5.0-R7CT-ND
U3 U4 = SV_CAT6219-330TDGT3: IC REG LIN 3.3V 500MA TSOT23-5; Voltage - Input (Max): 5.5V; Voltage Dropout (Max): 0.5V @ 500mA; Manufacturer Part Number: CAT6219-330TDGT3; Base Part Number: CAT6219; Current - Output: 500mA; Package / Case: SOT-23-5 Thin, TSOT-23-5; Supplier: Digi-Key; Supplier Device Package: TSOT-23-5; Voltage - Output (Min/Fixed): 3.3V; ComponentLink1URL: http://www.onsemi.com/pub/Collateral/CAT6219-D.PDF; ComponentLink1Description: http://www.onsemi.com/pub/Collateral/CAT6219-D.PDF; Supplier 1: Digi-Key
U5 = NRF24: nRF24 SMD Module
U6 = DRV8833: Dual H-Bridge Motor Driver 1.5A
U7 = SN74LVC1T45: 1.8V - 5V level converter
Y1 = XT_CRYSTAL_12MHz: 12.00 MHZ 18PF HC49/4H SMD; Manufacturer: Abracon Corporation; Manufacturer PN: ABLS-8.000MHZ-B2-T; Supplier 1: Farnell; Supplier Part Number 1: 1842280; Storage Location: PCB Assembly WS; Supplier: ECE Dept; Supplier 2: Digi-Key; Supplier Part Number 2: 535-10218-1-ND; Value: 12MHz